# Altium schematic sheet Block Diagram.SchDoc
size A4; SheetNumber: 1; SheetTotal: 10
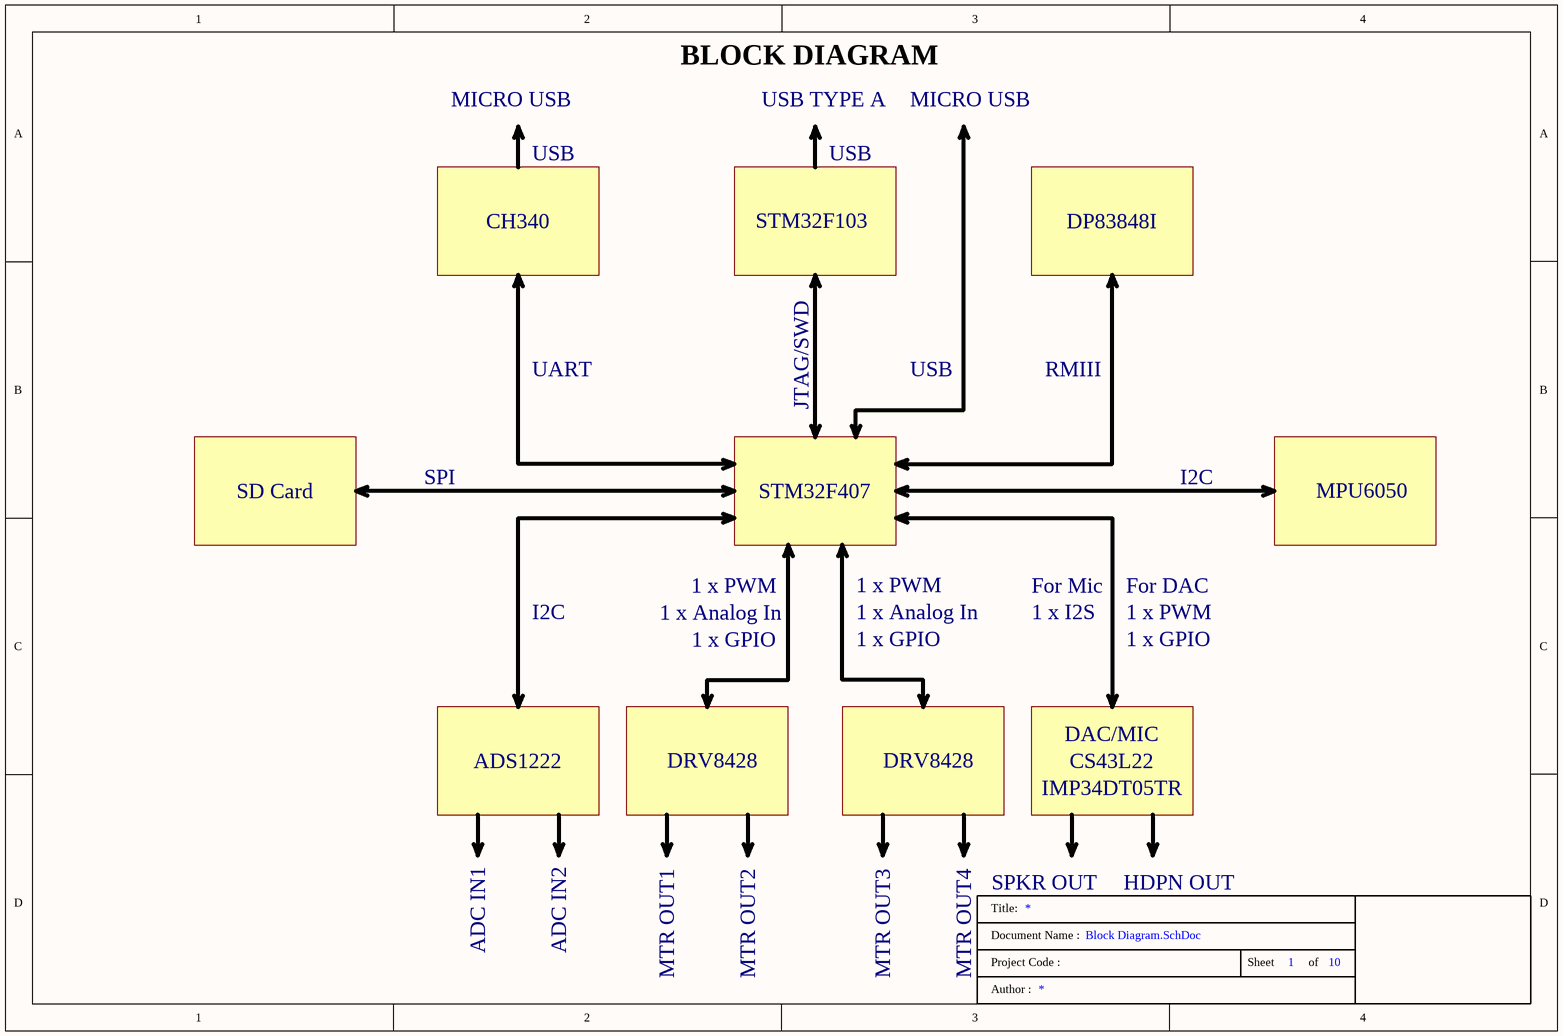
[diagram p0: Block Diagram.SchDoc]

## Notes on the sheet
- MICRO USB
- BLOCK DIAGRAM
- USB TYPE A
- USB
- CH340
- STM32F103
- DP83848I
- UART
- RMIII
- JTAG/SWD
- SD Card
- SPI
- STM32F407
- I2C
- MPU6050
- 1 x PWM
- For Mic
- For DAC
- 1 x Analog In
- 1 x GPIO
- 1 x I2S
- ADS1222
- DRV8428
- CS43L22
- IMP34DT05TR
- DAC/MIC
- ADC IN1
- ADC IN2
- MTR OUT1
- MTR OUT2
- MTR OUT3
- MTR OUT4
- SPKR OUT
- HDPN OUT
- Title:
- Document Name :
- Project Code :
- Sheet
- of
- Author :